# EAGLE schematic untitled (EAGLE 9.6.2)
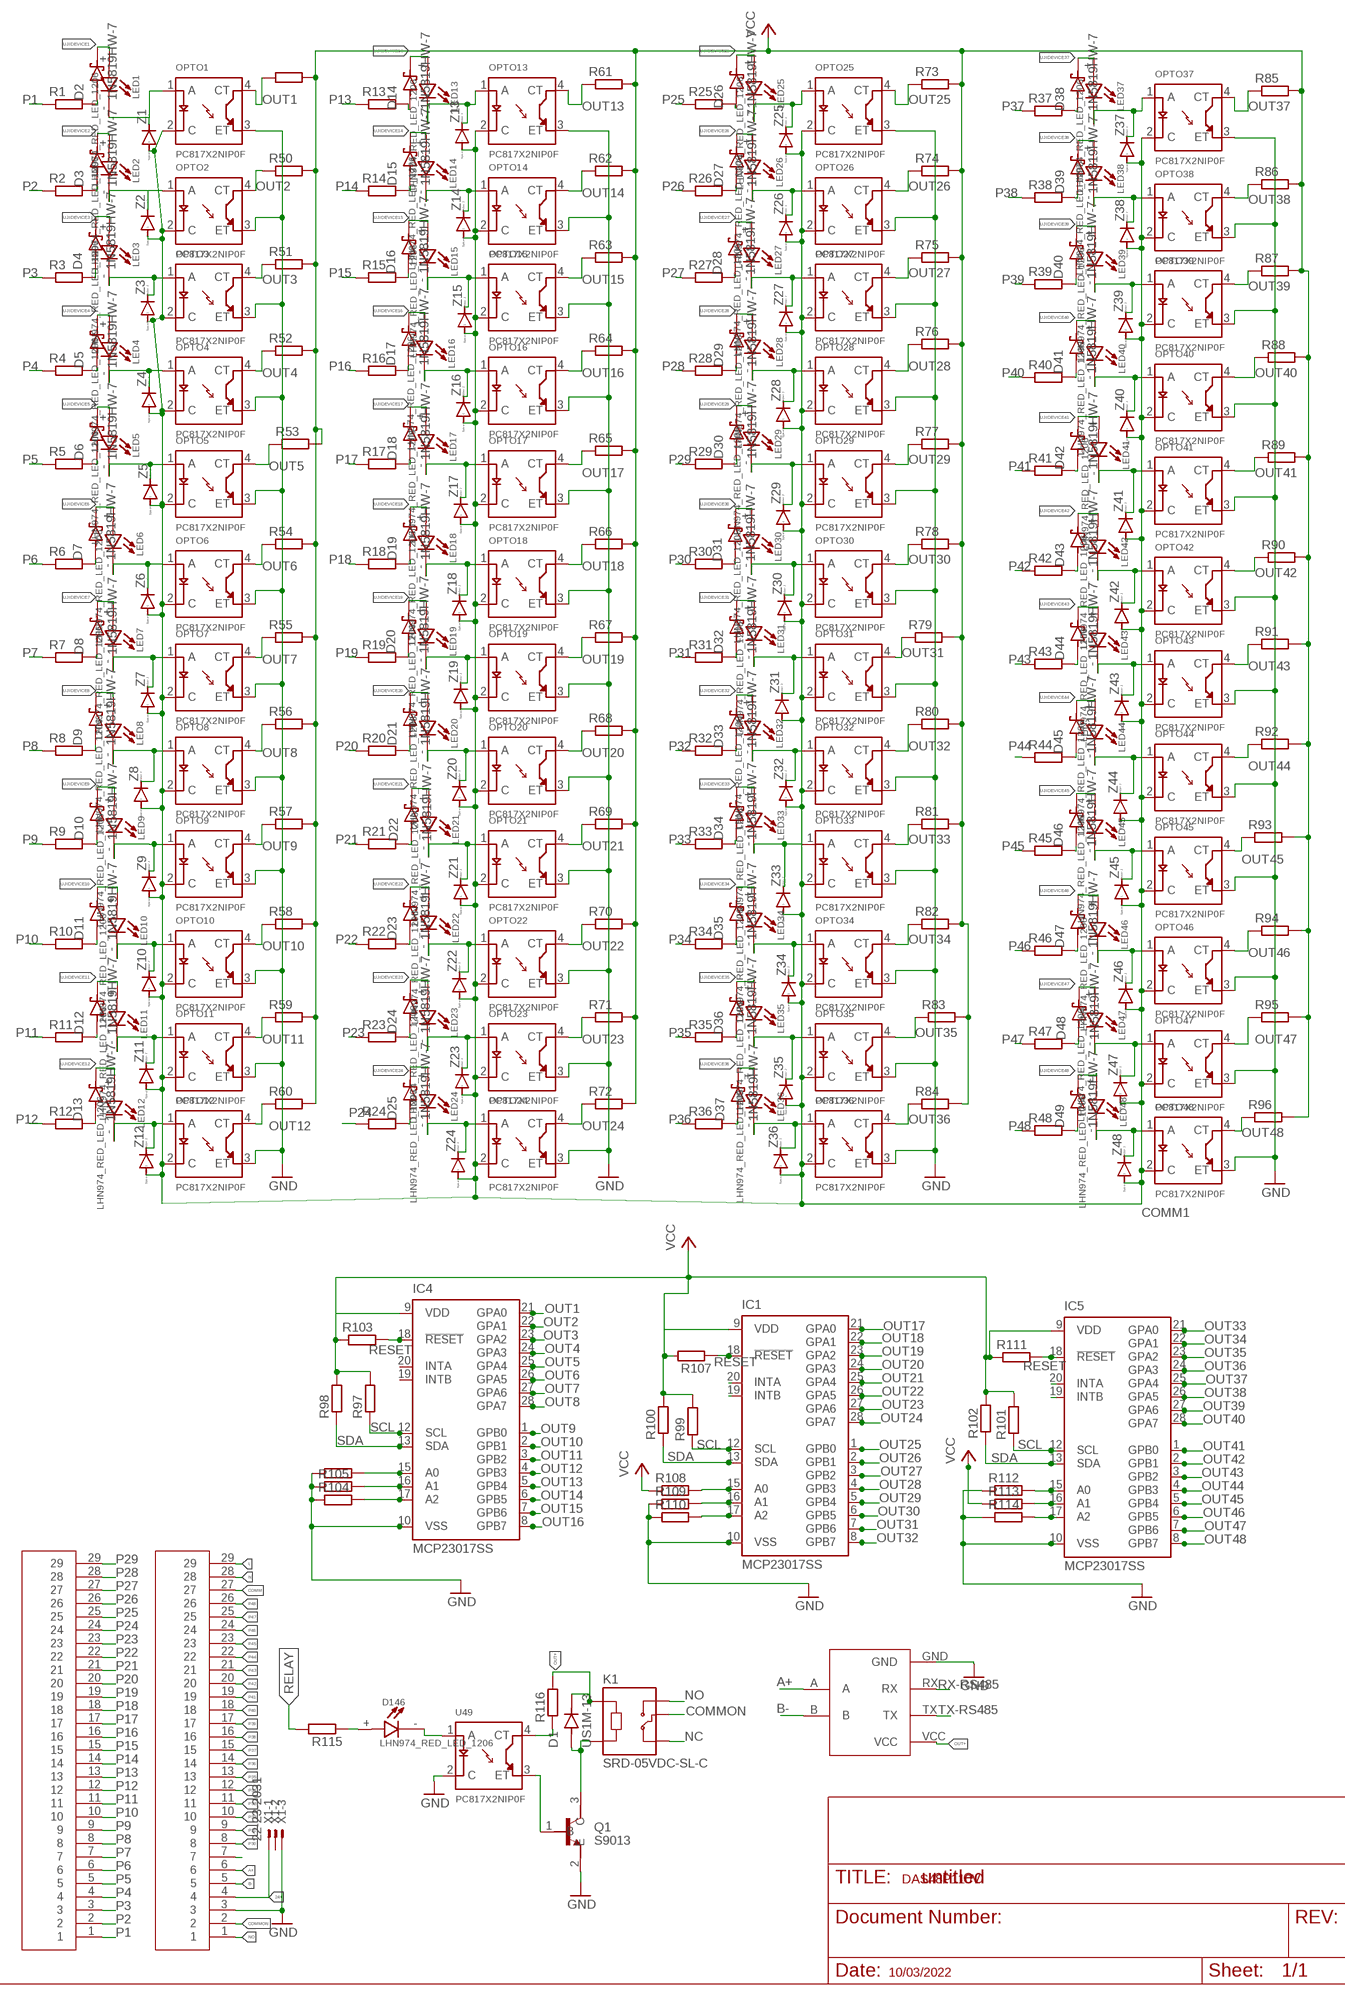
[diagram p0: schematic, sheet 1, part 1 of 2]
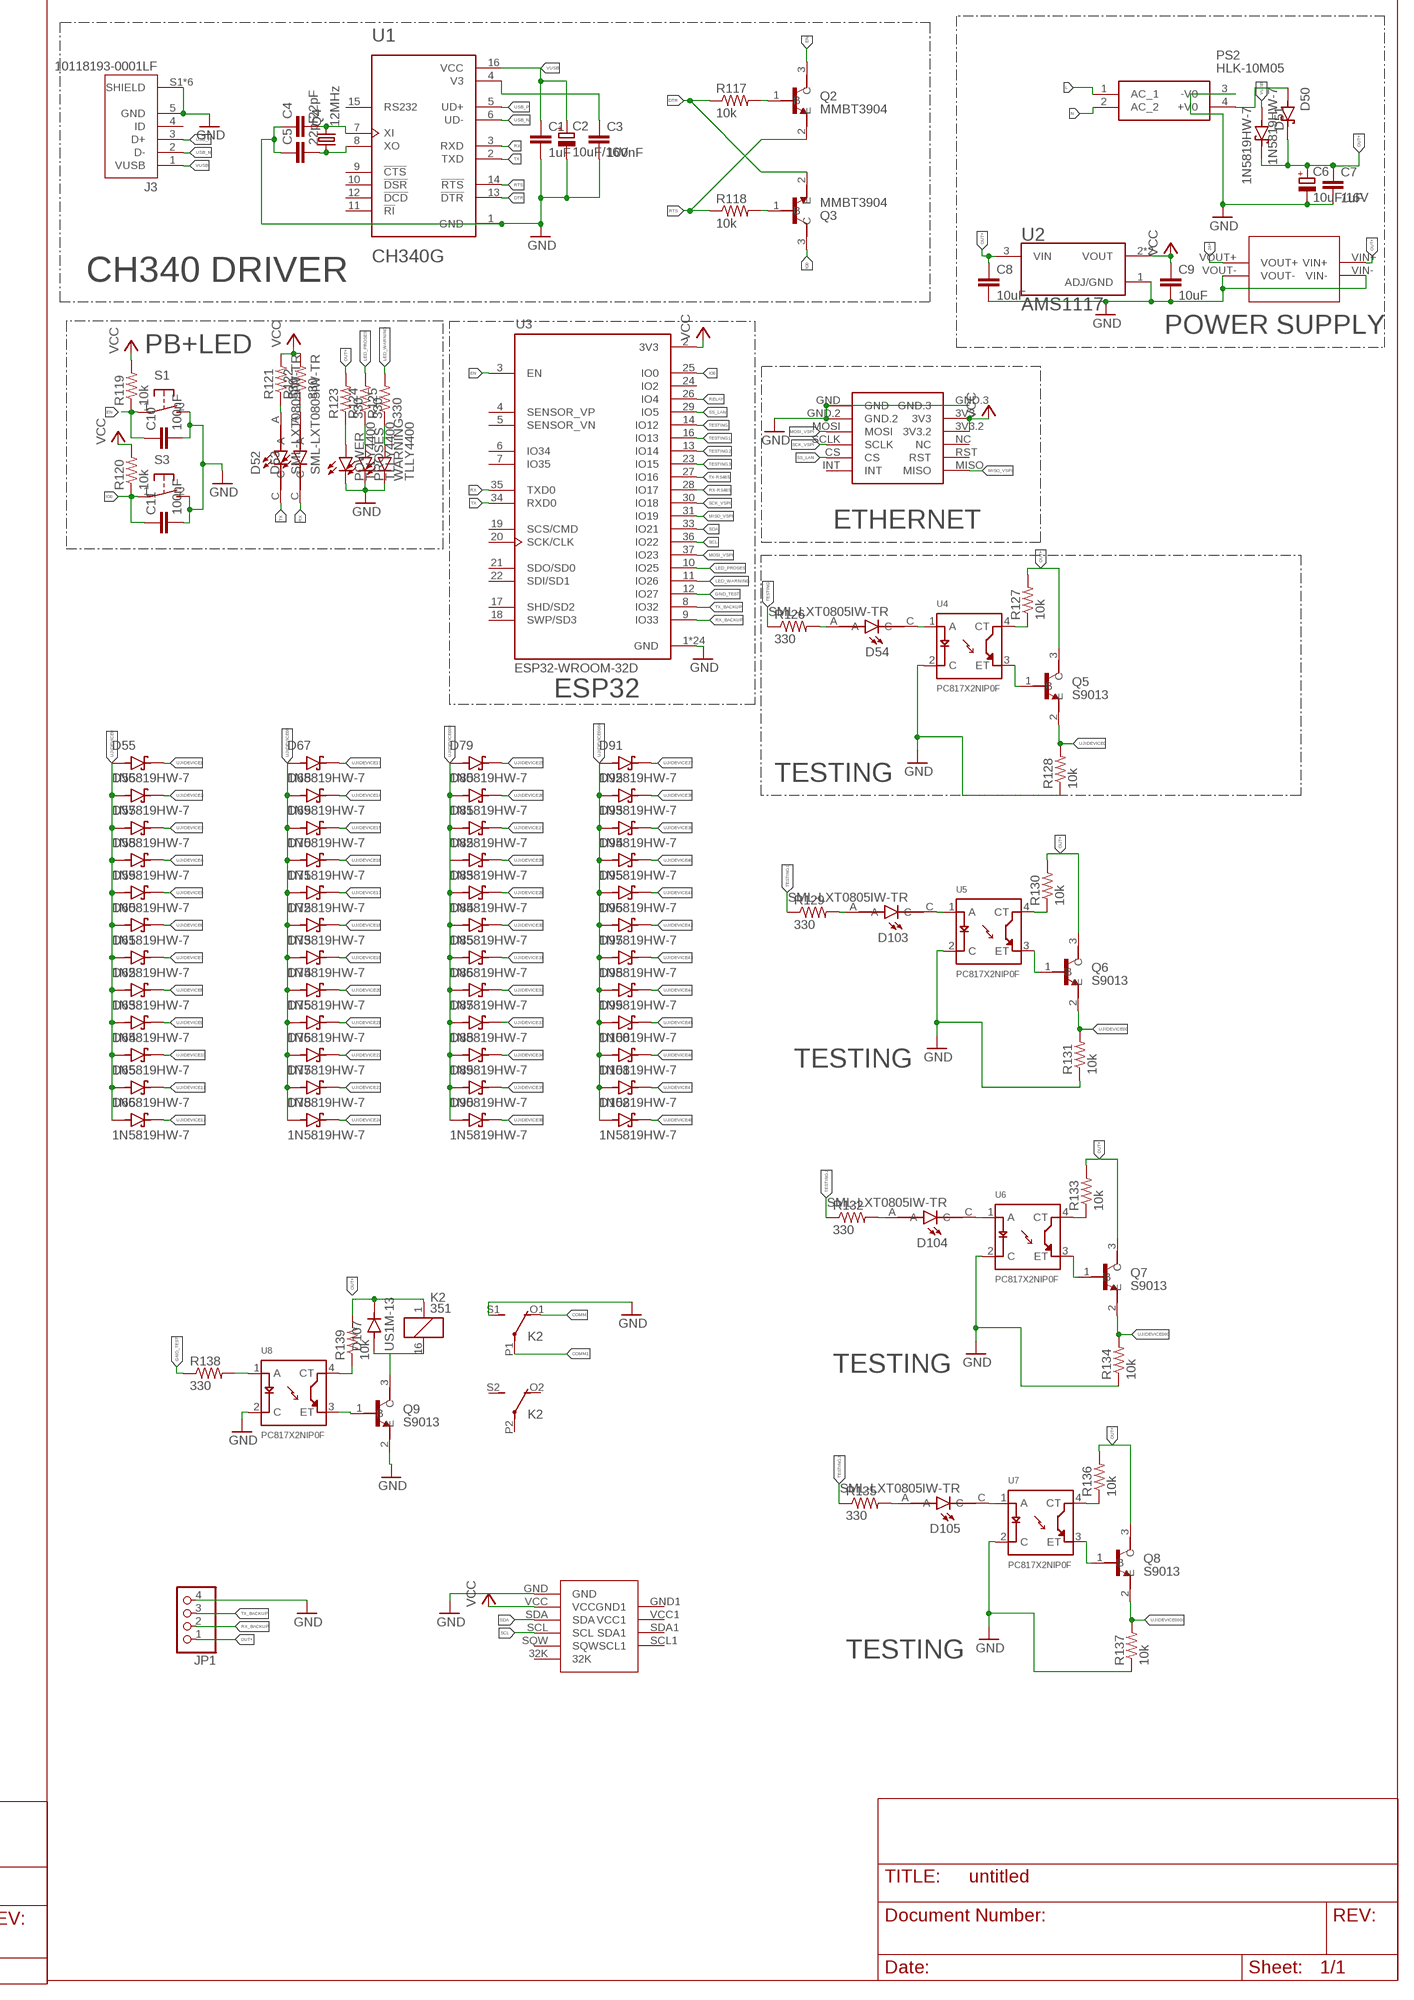
[diagram p1: schematic, sheet 1, part 2 of 2]

## Parts
C1  1uF  C-EUC0805K  [C0805K]
C2  10uF/16V  CPOL-EU153CLV-0505  [153CLV-0505]
C3  100nF  C-EUC0805K  [C0805K]
C4  22pF  C-EUC0805K  [C0805K]
C5  22pF  C-EUC0805K  [C0805K]
C6  10uF/16V  CPOL-EU153CLV-0505  [153CLV-0505]
C7  1uF  C-EUC0805K  [C0805K]
C8  10uF  C-EUC0805K  [C0805K]
C9  10uF  C-EUC0805K  [C0805K]
C10  100nF  C-EUC0805K  [C0805K]
C11  100nF  C-EUC0805K  [C0805K]
D1  US1M-13  [DIOM5226X240N]
D2  1N5819HW-7  [SOD3715X145N]
D3  1N5819HW-7  [SOD3715X145N]
D4  1N5819HW-7  [SOD3715X145N]
D5  1N5819HW-7  [SOD3715X145N]
D6  1N5819HW-7  [SOD3715X145N]
D7  1N5819HW-7  [SOD3715X145N]
D8  1N5819HW-7  [SOD3715X145N]
D9  1N5819HW-7  [SOD3715X145N]
D10  1N5819HW-7  [SOD3715X145N]
D11  1N5819HW-7  [SOD3715X145N]
D12  1N5819HW-7  [SOD3715X145N]
D13  1N5819HW-7  [SOD3715X145N]
D14  1N5819HW-7  [SOD3715X145N]
D15  1N5819HW-7  [SOD3715X145N]
D16  1N5819HW-7  [SOD3715X145N]
D17  1N5819HW-7  [SOD3715X145N]
D18  1N5819HW-7  [SOD3715X145N]
D19  1N5819HW-7  [SOD3715X145N]
D20  1N5819HW-7  [SOD3715X145N]
D21  1N5819HW-7  [SOD3715X145N]
D22  1N5819HW-7  [SOD3715X145N]
D23  1N5819HW-7  [SOD3715X145N]
D24  1N5819HW-7  [SOD3715X145N]
D25  1N5819HW-7  [SOD3715X145N]
D26  1N5819HW-7  [SOD3715X145N]
D27  1N5819HW-7  [SOD3715X145N]
D28  1N5819HW-7  [SOD3715X145N]
D29  1N5819HW-7  [SOD3715X145N]
D30  1N5819HW-7  [SOD3715X145N]
D31  1N5819HW-7  [SOD3715X145N]
D32  1N5819HW-7  [SOD3715X145N]
D33  1N5819HW-7  [SOD3715X145N]
D34  1N5819HW-7  [SOD3715X145N]
D35  1N5819HW-7  [SOD3715X145N]
D36  1N5819HW-7  [SOD3715X145N]
D37  1N5819HW-7  [SOD3715X145N]
D38  1N5819HW-7  [SOD3715X145N]
D39  1N5819HW-7  [SOD3715X145N]
D40  1N5819HW-7  [SOD3715X145N]
D41  1N5819HW-7  [SOD3715X145N]
D42  1N5819HW-7  [SOD3715X145N]
D43  1N5819HW-7  [SOD3715X145N]
D44  1N5819HW-7  [SOD3715X145N]
D45  1N5819HW-7  [SOD3715X145N]
D46  1N5819HW-7  [SOD3715X145N]
D47  1N5819HW-7  [SOD3715X145N]
D48  1N5819HW-7  [SOD3715X145N]
D49  1N5819HW-7  [SOD3715X145N]
D50  1N5819HW-7  [SOD3715X145N]
D51  1N5819HW-7  [SOD3715X145N]
D52  SML-LXT0805IW-TR  [LEDC2012X120N]
D53  SML-LXT0805IW-TR  [LEDC2012X120N]
D54  SML-LXT0805IW-TR  [LEDC2012X120N]
D55  1N5819HW-7  [SOD3715X145N]
D56  1N5819HW-7  [SOD3715X145N]
D57  1N5819HW-7  [SOD3715X145N]
D58  1N5819HW-7  [SOD3715X145N]
D59  1N5819HW-7  [SOD3715X145N]
D60  1N5819HW-7  [SOD3715X145N]
D61  1N5819HW-7  [SOD3715X145N]
D62  1N5819HW-7  [SOD3715X145N]
D63  1N5819HW-7  [SOD3715X145N]
D64  1N5819HW-7  [SOD3715X145N]
D65  1N5819HW-7  [SOD3715X145N]
D66  1N5819HW-7  [SOD3715X145N]
D67  1N5819HW-7  [SOD3715X145N]
D68  1N5819HW-7  [SOD3715X145N]
D69  1N5819HW-7  [SOD3715X145N]
D70  1N5819HW-7  [SOD3715X145N]
D71  1N5819HW-7  [SOD3715X145N]
D72  1N5819HW-7  [SOD3715X145N]
D73  1N5819HW-7  [SOD3715X145N]
D74  1N5819HW-7  [SOD3715X145N]
D75  1N5819HW-7  [SOD3715X145N]
D76  1N5819HW-7  [SOD3715X145N]
D77  1N5819HW-7  [SOD3715X145N]
D78  1N5819HW-7  [SOD3715X145N]
D79  1N5819HW-7  [SOD3715X145N]
D80  1N5819HW-7  [SOD3715X145N]
D81  1N5819HW-7  [SOD3715X145N]
D82  1N5819HW-7  [SOD3715X145N]
D83  1N5819HW-7  [SOD3715X145N]
D84  1N5819HW-7  [SOD3715X145N]
D85  1N5819HW-7  [SOD3715X145N]
D86  1N5819HW-7  [SOD3715X145N]
D87  1N5819HW-7  [SOD3715X145N]
D88  1N5819HW-7  [SOD3715X145N]
D89  1N5819HW-7  [SOD3715X145N]
D90  1N5819HW-7  [SOD3715X145N]
D91  1N5819HW-7  [SOD3715X145N]
D92  1N5819HW-7  [SOD3715X145N]
D93  1N5819HW-7  [SOD3715X145N]
D94  1N5819HW-7  [SOD3715X145N]
D95  1N5819HW-7  [SOD3715X145N]
D96  1N5819HW-7  [SOD3715X145N]
D97  1N5819HW-7  [SOD3715X145N]
D98  1N5819HW-7  [SOD3715X145N]
D99  1N5819HW-7  [SOD3715X145N]
D100  1N5819HW-7  [SOD3715X145N]
D101  1N5819HW-7  [SOD3715X145N]
D102  1N5819HW-7  [SOD3715X145N]
D103  SML-LXT0805IW-TR  [LEDC2012X120N]
D104  SML-LXT0805IW-TR  [LEDC2012X120N]
D105  SML-LXT0805IW-TR  [LEDC2012X120N]
D107  US1M-13  [DIOM5226X240N]
D146  LHN974_RED_LED_1206  [LEDC3216X120N]
HEADER-29P1  HEADER-29P  [HEADER-29P]
HEADER-29P2  HEADER-29P  [HEADER-29P]
IC1  MCP23017SS  [SSOP28DB]
IC4  MCP23017SS  [SSOP28DB]
IC5  MCP23017SS  [SSOP28DB]
J3  10118193-0001LF  [FCI_10118193-0001LF]
JP1  PINHD-1X4  [1X04]
K1  SRD-05VDC-SL-C  [RELAY_SRD-05VDC-SL-C]
K2  351  [351]
LED1  LHN974_RED_LED_1206  [LEDC3216X120N]
LED2  LHN974_RED_LED_1206  [LEDC3216X120N]
LED3  LHN974_RED_LED_1206  [LEDC3216X120N]
LED4  LHN974_RED_LED_1206  [LEDC3216X120N]
LED5  LHN974_RED_LED_1206  [LEDC3216X120N]
LED6  LHN974_RED_LED_1206  [LEDC3216X120N]
LED7  LHN974_RED_LED_1206  [LEDC3216X120N]
LED8  LHN974_RED_LED_1206  [LEDC3216X120N]
LED9  LHN974_RED_LED_1206  [LEDC3216X120N]
LED10  LHN974_RED_LED_1206  [LEDC3216X120N]
LED11  LHN974_RED_LED_1206  [LEDC3216X120N]
LED12  LHN974_RED_LED_1206  [LEDC3216X120N]
LED13  LHN974_RED_LED_1206  [LEDC3216X120N]
LED14  LHN974_RED_LED_1206  [LEDC3216X120N]
LED15  LHN974_RED_LED_1206  [LEDC3216X120N]
LED16  LHN974_RED_LED_1206  [LEDC3216X120N]
LED17  LHN974_RED_LED_1206  [LEDC3216X120N]
LED18  LHN974_RED_LED_1206  [LEDC3216X120N]
LED19  LHN974_RED_LED_1206  [LEDC3216X120N]
LED20  LHN974_RED_LED_1206  [LEDC3216X120N]
LED21  LHN974_RED_LED_1206  [LEDC3216X120N]
LED22  LHN974_RED_LED_1206  [LEDC3216X120N]
LED23  LHN974_RED_LED_1206  [LEDC3216X120N]
LED24  LHN974_RED_LED_1206  [LEDC3216X120N]
LED25  LHN974_RED_LED_1206  [LEDC3216X120N]
LED26  LHN974_RED_LED_1206  [LEDC3216X120N]
LED27  LHN974_RED_LED_1206  [LEDC3216X120N]
LED28  LHN974_RED_LED_1206  [LEDC3216X120N]
LED29  LHN974_RED_LED_1206  [LEDC3216X120N]
LED30  LHN974_RED_LED_1206  [LEDC3216X120N]
LED31  LHN974_RED_LED_1206  [LEDC3216X120N]
LED32  LHN974_RED_LED_1206  [LEDC3216X120N]
LED33  LHN974_RED_LED_1206  [LEDC3216X120N]
LED34  LHN974_RED_LED_1206  [LEDC3216X120N]
LED35  LHN974_RED_LED_1206  [LEDC3216X120N]
LED36  LHN974_RED_LED_1206  [LEDC3216X120N]
LED37  LHN974_RED_LED_1206  [LEDC3216X120N]
LED38  LHN974_RED_LED_1206  [LEDC3216X120N]
LED39  LHN974_RED_LED_1206  [LEDC3216X120N]
LED40  LHN974_RED_LED_1206  [LEDC3216X120N]
LED41  LHN974_RED_LED_1206  [LEDC3216X120N]
LED42  LHN974_RED_LED_1206  [LEDC3216X120N]
LED43  LHN974_RED_LED_1206  [LEDC3216X120N]
LED44  LHN974_RED_LED_1206  [LEDC3216X120N]
LED45  LHN974_RED_LED_1206  [LEDC3216X120N]
LED46  LHN974_RED_LED_1206  [LEDC3216X120N]
LED47  LHN974_RED_LED_1206  [LEDC3216X120N]
LED48  LHN974_RED_LED_1206  [LEDC3216X120N]
MT1  MT3608  [MT3608]
OPTO1  PC817X2NIP0F  [SOT254P975X400-4N]
OPTO2  PC817X2NIP0F  [SOT254P975X400-4N]
OPTO3  PC817X2NIP0F  [SOT254P975X400-4N]
OPTO4  PC817X2NIP0F  [SOT254P975X400-4N]
OPTO5  PC817X2NIP0F  [SOT254P975X400-4N]
OPTO6  PC817X2NIP0F  [SOT254P975X400-4N]
OPTO7  PC817X2NIP0F  [SOT254P975X400-4N]
OPTO8  PC817X2NIP0F  [SOT254P975X400-4N]
OPTO9  PC817X2NIP0F  [SOT254P975X400-4N]
OPTO10  PC817X2NIP0F  [SOT254P975X400-4N]
OPTO11  PC817X2NIP0F  [SOT254P975X400-4N]
OPTO12  PC817X2NIP0F  [SOT254P975X400-4N]
OPTO13  PC817X2NIP0F  [SOT254P975X400-4N]
OPTO14  PC817X2NIP0F  [SOT254P975X400-4N]
OPTO15  PC817X2NIP0F  [SOT254P975X400-4N]
OPTO16  PC817X2NIP0F  [SOT254P975X400-4N]
OPTO17  PC817X2NIP0F  [SOT254P975X400-4N]
OPTO18  PC817X2NIP0F  [SOT254P975X400-4N]
OPTO19  PC817X2NIP0F  [SOT254P975X400-4N]
OPTO20  PC817X2NIP0F  [SOT254P975X400-4N]
OPTO21  PC817X2NIP0F  [SOT254P975X400-4N]
OPTO22  PC817X2NIP0F  [SOT254P975X400-4N]
OPTO23  PC817X2NIP0F  [SOT254P975X400-4N]
OPTO24  PC817X2NIP0F  [SOT254P975X400-4N]
OPTO25  PC817X2NIP0F  [SOT254P975X400-4N]
OPTO26  PC817X2NIP0F  [SOT254P975X400-4N]
OPTO27  PC817X2NIP0F  [SOT254P975X400-4N]
OPTO28  PC817X2NIP0F  [SOT254P975X400-4N]
OPTO29  PC817X2NIP0F  [SOT254P975X400-4N]
OPTO30  PC817X2NIP0F  [SOT254P975X400-4N]
OPTO31  PC817X2NIP0F  [SOT254P975X400-4N]
OPTO32  PC817X2NIP0F  [SOT254P975X400-4N]
OPTO33  PC817X2NIP0F  [SOT254P975X400-4N]
OPTO34  PC817X2NIP0F  [SOT254P975X400-4N]
OPTO35  PC817X2NIP0F  [SOT254P975X400-4N]
OPTO36  PC817X2NIP0F  [SOT254P975X400-4N]
OPTO37  PC817X2NIP0F  [SOT254P975X400-4N]
OPTO38  PC817X2NIP0F  [SOT254P975X400-4N]
OPTO39  PC817X2NIP0F  [SOT254P975X400-4N]
OPTO40  PC817X2NIP0F  [SOT254P975X400-4N]
OPTO41  PC817X2NIP0F  [SOT254P975X400-4N]
OPTO42  PC817X2NIP0F  [SOT254P975X400-4N]
OPTO43  PC817X2NIP0F  [SOT254P975X400-4N]
OPTO44  PC817X2NIP0F  [SOT254P975X400-4N]
OPTO45  PC817X2NIP0F  [SOT254P975X400-4N]
OPTO46  PC817X2NIP0F  [SOT254P975X400-4N]
OPTO47  PC817X2NIP0F  [SOT254P975X400-4N]
OPTO48  PC817X2NIP0F  [SOT254P975X400-4N]
POWER  TLLY4400  [LED3MM]
PROSES  TLLY4400  [LED3MM]
PS2  HLK-10M05  [HLK10M05]
Q1  S9013  [SOT95P240X120-3N]
Q2  MMBT3904  [SOT95P240X120-3N]
Q3  MMBT3904  [SOT95P240X120-3N]
Q4  12MHz  CRYSTALSM49  [SM49]
Q5  S9013  [SOT95P240X120-3N]
Q6  S9013  [SOT95P240X120-3N]
Q7  S9013  [SOT95P240X120-3N]
Q8  S9013  [SOT95P240X120-3N]
Q9  S9013  [SOT95P240X120-3N]
R1  R-EU_0617/17  [0617/17]
R2  R-EU_0617/17  [0617/17]
R3  R-EU_0617/17  [0617/17]
R4  R-EU_0617/17  [0617/17]
R5  R-EU_0617/17  [0617/17]
R6  R-EU_0617/17  [0617/17]
R7  R-EU_0617/17  [0617/17]
R8  R-EU_0617/17  [0617/17]
R9  R-EU_0617/17  [0617/17]
R10  R-EU_0617/17  [0617/17]
R11  R-EU_0617/17  [0617/17]
R12  R-EU_0617/17  [0617/17]
R13  R-EU_0617/17  [0617/17]
R14  R-EU_0617/17  [0617/17]
R15  R-EU_0617/17  [0617/17]
R16  R-EU_0617/17  [0617/17]
R17  R-EU_0617/17  [0617/17]
R18  R-EU_0617/17  [0617/17]
R19  R-EU_0617/17  [0617/17]
R20  R-EU_0617/17  [0617/17]
R21  R-EU_0617/17  [0617/17]
R22  R-EU_0617/17  [0617/17]
R23  R-EU_0617/17  [0617/17]
R24  R-EU_0617/17  [0617/17]
R25  R-EU_0617/17  [0617/17]
R26  R-EU_0617/17  [0617/17]
R27  R-EU_0617/17  [0617/17]
R28  R-EU_0617/17  [0617/17]
R29  R-EU_0617/17  [0617/17]
R30  R-EU_0617/17  [0617/17]
R31  R-EU_0617/17  [0617/17]
R32  R-EU_0617/17  [0617/17]
R33  R-EU_0617/17  [0617/17]
R34  R-EU_0617/17  [0617/17]
R35  R-EU_0617/17  [0617/17]
R36  R-EU_0617/17  [0617/17]
R37  R-EU_0617/17  [0617/17]
R38  R-EU_0617/17  [0617/17]
R39  R-EU_0617/17  [0617/17]
R40  R-EU_0617/17  [0617/17]
R41  R-EU_0617/17  [0617/17]
R42  R-EU_0617/17  [0617/17]
R43  R-EU_0617/17  [0617/17]
R44  R-EU_0617/17  [0617/17]
R45  R-EU_0617/17  [0617/17]
R46  R-EU_0617/17  [0617/17]
R47  R-EU_0617/17  [0617/17]
R48  R-EU_0617/17  [0617/17]
R49  R-EU_R0805  [R0805]
R50  R-EU_R0805  [R0805]
R51  R-EU_R0805  [R0805]
R52  R-EU_R0805  [R0805]
R53  R-EU_R0805  [R0805]
R54  R-EU_R0805  [R0805]
R55  R-EU_R0805  [R0805]
R56  R-EU_R0805  [R0805]
R57  R-EU_R0805  [R0805]
R58  R-EU_R0805  [R0805]
R59  R-EU_R0805  [R0805]
R60  R-EU_R0805  [R0805]
R61  R-EU_R0805  [R0805]
R62  R-EU_R0805  [R0805]
R63  R-EU_R0805  [R0805]
R64  R-EU_R0805  [R0805]
R65  R-EU_R0805  [R0805]
R66  R-EU_R0805  [R0805]
R67  R-EU_R0805  [R0805]
R68  R-EU_R0805  [R0805]
R69  R-EU_R0805  [R0805]
R70  R-EU_R0805  [R0805]
R71  R-EU_R0805  [R0805]
R72  R-EU_R0805  [R0805]
R73  R-EU_R0805  [R0805]
R74  R-EU_R0805  [R0805]
R75  R-EU_R0805  [R0805]
R76  R-EU_R0805  [R0805]
R77  R-EU_R0805  [R0805]
R78  R-EU_R0805  [R0805]
R79  R-EU_R0805  [R0805]
R80  R-EU_R0805  [R0805]
R81  R-EU_R0805  [R0805]
R82  R-EU_R0805  [R0805]
R83  R-EU_R0805  [R0805]
R84  R-EU_R0805  [R0805]
R85  R-EU_R0805  [R0805]
R86  R-EU_R0805  [R0805]
R87  R-EU_R0805  [R0805]
R88  R-EU_R0805  [R0805]
R89  R-EU_R0805  [R0805]
R90  R-EU_R0805  [R0805]
R91  R-EU_R0805  [R0805]
R92  R-EU_R0805  [R0805]
R93  R-EU_R0805  [R0805]
R94  R-EU_R0805  [R0805]
R95  R-EU_R0805  [R0805]
R96  R-EU_R0805  [R0805]
R97  R-EU_R0805  [R0805]
R98  R-EU_R0805  [R0805]
R99  R-EU_R0805  [R0805]
R100  R-EU_R0805  [R0805]
R101  R-EU_R0805  [R0805]
R102  R-EU_R0805  [R0805]
R103  R-EU_R0805  [R0805]
R104  R-EU_R0805  [R0805]
R105  R-EU_R0805  [R0805]
R106  R-EU_R0805  [R0805]
R107  R-EU_R0805  [R0805]
R108  R-EU_R0805  [R0805]
R109  R-EU_R0805  [R0805]
R110  R-EU_R0805  [R0805]
R111  R-EU_R0805  [R0805]
R112  R-EU_R0805  [R0805]
R113  R-EU_R0805  [R0805]
R114  R-EU_R0805  [R0805]
R115  R-EU_R0805  [R0805]
R116  R-EU_R0805  [R0805]
R117  10k  R-US_M0805  [M0805]
R118  10k  R-US_M0805  [M0805]
R119  10k  R-US_M0805  [M0805]
R120  10k  R-US_M0805  [M0805]
R121  330  R-US_M0805  [M0805]
R122  330  R-US_M0805  [M0805]
R123  330  R-US_M0805  [M0805]
R124  330  R-US_M0805  [M0805]
R125  330  R-US_M0805  [M0805]
R126  330  R-US_M0805  [M0805]
R127  10k  R-US_M0805  [M0805]
R128  10k  R-US_M0805  [M0805]
R129  330  R-US_M0805  [M0805]
R130  10k  R-US_M0805  [M0805]
R131  10k  R-US_M0805  [M0805]
R132  330  R-US_M0805  [M0805]
R133  10k  R-US_M0805  [M0805]
R134  10k  R-US_M0805  [M0805]
R135  330  R-US_M0805  [M0805]
R136  10k  R-US_M0805  [M0805]
R137  10k  R-US_M0805  [M0805]
R138  330  R-US_M0805  [M0805]
R139  10k  R-US_M0805  [M0805]
RTC1  RTC3231  [RTC3231]
S1  31-XX  [B3F-31XX]
S3  31-XX  [B3F-31XX]
TTL-RS1  TTL-RS485  [TTL-RS485]
U1  CH340G  [SOIC127P600X180-16N]
U2  AMS1117  [SOT229P700X180-4N]
U3  ESP32-WROOM-32D  [MODULE_ESP32-WROOM-32D]
U4  PC817X2NIP0F  [SOT254P975X400-4N]
U5  PC817X2NIP0F  [SOT254P975X400-4N]
U6  PC817X2NIP0F  [SOT254P975X400-4N]
U7  PC817X2NIP0F  [SOT254P975X400-4N]
U8  PC817X2NIP0F  [SOT254P975X400-4N]
U49  PC817X2NIP0F  [SOT254P975X400-4N]
U$1  MINI_W5500  [MINI_W5500]
WARNING  TLLY4400  [LED3MM]
X1  22-23-2031  [22-23-2031]
Z1  DIODE-SOD123  [SOD123]
Z2  DIODE-SOD123  [SOD123]
Z3  DIODE-SOD123  [SOD123]
Z4  DIODE-SOD123  [SOD123]
Z5  DIODE-SOD123  [SOD123]
Z6  DIODE-SOD123  [SOD123]
Z7  DIODE-SOD123  [SOD123]
Z8  DIODE-SOD123  [SOD123]
Z9  DIODE-SOD123  [SOD123]
Z10  DIODE-SOD123  [SOD123]
Z11  DIODE-SOD123  [SOD123]
Z12  DIODE-SOD123  [SOD123]
Z13  DIODE-SOD123  [SOD123]
Z14  DIODE-SOD123  [SOD123]
Z15  DIODE-SOD123  [SOD123]
Z16  DIODE-SOD123  [SOD123]
Z17  DIODE-SOD123  [SOD123]
Z18  DIODE-SOD123  [SOD123]
Z19  DIODE-SOD123  [SOD123]
Z20  DIODE-SOD123  [SOD123]
Z21  DIODE-SOD123  [SOD123]
Z22  DIODE-SOD123  [SOD123]
Z23  DIODE-SOD123  [SOD123]
Z24  DIODE-SOD123  [SOD123]
Z25  DIODE-SOD123  [SOD123]
Z26  DIODE-SOD123  [SOD123]
Z27  DIODE-SOD123  [SOD123]
Z28  DIODE-SOD123  [SOD123]
Z29  DIODE-SOD123  [SOD123]
Z30  DIODE-SOD123  [SOD123]
Z31  DIODE-SOD123  [SOD123]
Z32  DIODE-SOD123  [SOD123]
Z33  DIODE-SOD123  [SOD123]
Z34  DIODE-SOD123  [SOD123]
Z35  DIODE-SOD123  [SOD123]
Z36  DIODE-SOD123  [SOD123]
Z37  DIODE-SOD123  [SOD123]
Z38  DIODE-SOD123  [SOD123]
Z39  DIODE-SOD123  [SOD123]
Z40  DIODE-SOD123  [SOD123]
Z41  DIODE-SOD123  [SOD123]
Z42  DIODE-SOD123  [SOD123]
Z43  DIODE-SOD123  [SOD123]
Z44  DIODE-SOD123  [SOD123]
Z45  DIODE-SOD123  [SOD123]
Z46  DIODE-SOD123  [SOD123]
Z47  DIODE-SOD123  [SOD123]
Z48  DIODE-SOD123  [SOD123]

## Nets
24+: HEADER-29P2.4 MT1.VOUT+ X1.1
A+: HEADER-29P2.6 TTL-RS1.A
B-: HEADER-29P2.5 TTL-RS1.B
COMM: HEADER-29P2.27 K2.O1(2:O)
COMM1: K2.P1(2:P) OPTO1.2(C) OPTO2.2(C) OPTO3.2(C) OPTO4.2(C) OPTO5.2(C) OPTO6.2(C) OPTO7.2(C) OPTO8.2(C) OPTO9.2(C) OPTO10.2(C) OPTO11.2(C) OPTO12.2(C) OPTO13.2(C) OPTO14.2(C) OPTO15.2(C) OPTO16.2(C) OPTO17.2(C) OPTO18.2(C) OPTO19.2(C) OPTO20.2(C) OPTO21.2(C) OPTO22.2(C) OPTO23.2(C) OPTO24.2(C) OPTO25.2(C) OPTO26.2(C) OPTO27.2(C) OPTO28.2(C) OPTO29.2(C) OPTO30.2(C) OPTO31.2(C) OPTO32.2(C) OPTO33.2(C) OPTO34.2(C) OPTO35.2(C) OPTO36.2(C) OPTO37.2(C) OPTO38.2(C) OPTO39.2(C) OPTO40.2(C) OPTO41.2(C) OPTO42.2(C) OPTO43.2(C) OPTO44.2(C) OPTO45.2(C) OPTO46.2(C) OPTO47.2(C) OPTO48.2(C) Z1.A Z2.A Z3.A Z4.A Z5.A Z6.A Z7.A Z8.A Z9.A Z10.A Z11.A Z12.A Z13.A Z14.A Z15.A Z16.A Z17.A Z18.A Z19.A Z20.A Z21.A Z22.A Z23.A Z24.A Z25.A Z26.A Z27.A Z28.A Z29.A Z30.A Z31.A Z32.A Z33.A Z34.A Z35.A Z36.A Z37.A Z38.A Z39.A Z40.A Z41.A Z42.A Z43.A Z44.A Z45.A Z46.A Z47.A Z48.A
COMMON: HEADER-29P2.2 K1.COM
DTR: Q3.2(E) R117.1 U1.13(!DTR)
EN: C10.1 Q2.3(C) R119.1 S1.1(P) U3.3(EN)
GND: C1.2 C2.- C3.2 C4.1 C5.1 C6.- C7.2 C8.2 C9.2 C10.2 C11.2 HEADER-29P2.3 IC1.10(VSS) IC4.10(VSS) IC5.10(VSS) J3.5(GND) J3.S1(SHIELD) J3.S2(SHIELD) J3.S3(SHIELD) J3.S4(SHIELD) J3.S5(SHIELD) J3.S6(SHIELD) JP1.4 K2.S1(2:S) MT1.VIN- MT1.VOUT- OPTO1.3(ET) OPTO2.3(ET) OPTO3.3(ET) OPTO4.3(ET) OPTO5.3(ET) OPTO6.3(ET) OPTO7.3(ET) OPTO8.3(ET) OPTO9.3(ET) OPTO10.3(ET) OPTO11.3(ET) OPTO12.3(ET) OPTO13.3(ET) OPTO14.3(ET) OPTO15.3(ET) OPTO16.3(ET) OPTO17.3(ET) OPTO18.3(ET) OPTO19.3(ET) OPTO20.3(ET) OPTO21.3(ET) OPTO22.3(ET) OPTO23.3(ET) OPTO24.3(ET) OPTO25.3(ET) OPTO26.3(ET) OPTO27.3(ET) OPTO28.3(ET) OPTO29.3(ET) OPTO30.3(ET) OPTO31.3(ET) OPTO32.3(ET) OPTO33.3(ET) OPTO34.3(ET) OPTO35.3(ET) OPTO36.3(ET) OPTO37.3(ET) OPTO38.3(ET) OPTO39.3(ET) OPTO40.3(ET) OPTO41.3(ET) OPTO42.3(ET) OPTO43.3(ET) OPTO44.3(ET) OPTO45.3(ET) OPTO46.3(ET) OPTO47.3(ET) OPTO48.3(ET) POWER.K(C) PROSES.K(C) PS2.3(-V0) Q1.2(E) Q9.2(E) R104.1 R105.1 R106.1 R109.1 R110.1 R112.1 R114.1 R128.1 R131.1 R134.1 R137.1 RTC1.GND S1.2(S) S3.2(S) TTL-RS1.GND U1.1(GND) U2.1(ADJ/GND) U3.1(GND) U3.15(GND) U3.38(GND) U3.39_1(GND) U3.39_2(GND) U3.39_3(GND) U3.39_4(GND) U3.39_5(GND) U3.39_6(GND) U3.39_7(GND) U3.39_8(GND) U3.39_9(GND) U3.39_10(GND) U3.39_11(GND) U3.39_12(GND) U3.39_13(GND) U3.39_14(GND) U3.39_15(GND) U3.39_16(GND) U3.39_17(GND) U3.39_18(GND) U3.39_19(GND) U3.39_20(GND) U3.39_21(GND) U4.2(C) U5.2(C) U6.2(C) U7.2(C) U8.2(C) U49.2(C) U$1.GND U$1.GND.2 U$1.GND.3 WARNING.K(C) X1.3
GND_TEST: R138.1 U3.12(IO27)
IO0: C11.1 Q3.3(C) R120.1 S3.1(P) U3.25(IO0)
L: HEADER-29P2.29 PS2.1(AC_1)
LED_PROSES: R124.2 U3.10(IO25)
LED_WARNING: R125.2 U3.11(IO26)
MISO_VSPI: U3.31(IO19) U$1.MISO
MOSI_VSPI: U3.37(IO23) U$1.MOSI
N: HEADER-29P2.28 PS2.2(AC_2)
N$1: D2.A R1.2
N$2: D50.A PS2.4(+V0)
N$3: D3.A R2.2
N$4: Q5.1(B) U4.3(ET)
N$5: D4.A R3.2
N$6: R127.1 U4.4(CT)
N$7: D5.A R4.2
N$8: D103.A R129.2
N$9: D6.A R5.2
N$10: D103.C U5.1(A)
N$11: D7.A R6.2
N$12: Q6.1(B) U5.3(ET)
N$13: D8.A R7.2
N$14: R130.1 U5.4(CT)
N$15: D9.A R8.2
N$16: D104.A R132.2
N$17: D15.A R14.2
N$18: LED1.- OPTO1.1(A) Z1.C
N$19: LED13.- OPTO13.1(A) Z13.C
N$20: D10.A R9.2
N$21: LED14.- OPTO14.1(A) Z14.C
N$22: D104.C U6.1(A)
N$23: LED15.- OPTO15.1(A) Z15.C
N$24: D11.A R10.2
N$25: LED16.- OPTO16.1(A) Z16.C
N$26: Q7.1(B) U6.3(ET)
N$27: LED17.- OPTO17.1(A) Z17.C
N$28: D12.A R11.2
N$29: LED18.- OPTO18.1(A) Z18.C
N$30: R133.1 U6.4(CT)
N$31: LED19.- OPTO19.1(A) Z19.C
N$32: LED20.- OPTO20.1(A) Z20.C
N$33: LED21.- OPTO21.1(A) Z21.C
N$34: D105.A R135.2
N$35: LED22.- OPTO22.1(A) Z22.C
N$36: D13.A R12.2
N$37: LED23.- OPTO23.1(A) Z23.C
N$38: D105.C U7.1(A)
N$39: LED24.- OPTO24.1(A) Z24.C
N$40: D14.A R13.2
N$41: LED25.- OPTO25.1(A) Z25.C
N$42: Q8.1(B) U7.3(ET)
N$43: LED26.- OPTO26.1(A) Z26.C
N$44: D16.A R15.2
N$45: LED27.- OPTO27.1(A) Z27.C
N$46: R136.1 U7.4(CT)
N$47: LED28.- OPTO28.1(A) Z28.C
N$48: D17.A R16.2
N$49: LED29.- OPTO29.1(A) Z29.C
N$51: LED30.- OPTO30.1(A) Z30.C
N$52: D18.A R17.2
N$53: LED31.- OPTO31.1(A) Z31.C
N$54: R138.2 U8.1(A)
N$55: LED32.- OPTO32.1(A) Z32.C
N$56: D19.A R18.2
N$57: LED33.- OPTO33.1(A) Z33.C
N$58: R139.1 U8.4(CT)
N$59: LED34.- OPTO34.1(A) Z34.C
N$60: D20.A R19.2
N$61: LED35.- OPTO35.1(A) Z35.C
N$62: Q9.1(B) U8.3(ET)
N$63: LED36.- OPTO36.1(A) Z36.C
N$64: D32.A R31.2
N$65: LED37.- OPTO37.1(A) Z37.C
N$66: D21.A R20.2
N$67: LED38.- OPTO38.1(A) Z38.C
N$69: LED39.- OPTO39.1(A) Z39.C
N$70: LED40.- OPTO40.1(A) Z40.C
N$71: D22.A R21.2
N$72: LED41.- OPTO41.1(A) Z41.C
N$73: D107.A K2.16 Q9.3(C)
N$74: LED42.- OPTO42.1(A) Z42.C
N$75: LED43.- OPTO43.1(A) Z43.C
N$76: D23.A R22.2
N$77: LED44.- OPTO44.1(A) Z44.C
N$79: LED45.- OPTO45.1(A) Z45.C
N$80: D24.A R23.2
N$81: LED46.- OPTO46.1(A) Z46.C
N$83: LED47.- OPTO47.1(A) Z47.C
N$84: D25.A R24.2
N$85: LED48.- OPTO48.1(A) Z48.C
N$86: LED2.- OPTO2.1(A) Z2.C
N$87: LED3.- OPTO3.1(A) Z3.C
N$88: LED4.- OPTO4.1(A) Z4.C
N$89: LED5.- OPTO5.1(A) Z5.C
N$90: LED6.- OPTO6.1(A) Z6.C
N$91: LED7.- OPTO7.1(A) Z7.C
N$92: LED8.- OPTO8.1(A) Z8.C
N$93: LED9.- OPTO9.1(A) Z9.C
N$94: LED10.- OPTO10.1(A) Z10.C
N$95: LED11.- OPTO11.1(A) Z11.C
N$96: LED12.- OPTO12.1(A) Z12.C
N$97: D146.- U49.1(A)
N$98: D146.+ R115.1
N$99: R116.1 U49.4(CT)
N$100: IC5.15(A0) R112.2
N$101: D1.A K1.A2 Q1.3(C)
N$102: Q1.1(B) U49.3(ET)
N$103: IC5.16(A1) R113.2
N$105: D26.A R25.2
N$107: IC1.15(A0) R108.2
N$108: IC1.16(A1) R109.2
N$109: IC4.15(A0) R106.2
N$110: IC4.16(A1) R105.2
N$111: IC4.17(A2) R104.2
N$112: IC5.17(A2) R114.2
N$113: IC1.17(A2) R110.2
N$114: D27.A R26.2
N$116: D28.A R27.2
N$119: D29.A R28.2
N$122: D30.A R29.2
N$123: D31.A R30.2
N$126: D33.A R32.2
N$127: D35.A R34.2
N$129: D36.A R35.2
N$131: D42.A R41.2
N$132: D37.A R36.2
N$134: D38.A R37.2
N$135: IC1.20(INTA)
N$136: IC1.19(INTB)
N$137: IC5.20(INTA)
N$138: D34.A R33.2
N$140: IC5.19(INTB)
N$143: D39.A R38.2
N$145: D40.A R39.2
N$147: D41.A R40.2
N$151: D43.A R42.2
N$153: D44.A R43.2
N$155: D45.A R44.2
N$157: D46.A R45.2
N$159: D47.A R46.2
N$162: D54.A R126.2
N$163: D54.C U4.1(A)
N$164: D48.A R47.2
N$165: D49.A R48.2
N$168: C3.1 U1.4(V3)
N$169: C4.2 Q4.2 U1.7(XI)
N$170: C5.2 Q4.1 U1.8(XO)
N$173: POWER.A R123.1
N$174: PROSES.A R124.1
N$175: Q2.1(B) R117.2
N$176: Q3.1(B) R118.2
N$177: R125.1 WARNING.A
N$178: D52.A R121.1
N$179: D53.A R122.1
N$202: HEADER-29P2.7
NC: K1.NC
NO: HEADER-29P2.1 K1.NO
OUT1: IC4.21(GPA0) OPTO1.4(CT) R49.1
OUT2: IC4.22(GPA1) OPTO2.4(CT) R50.1
OUT3: IC4.23(GPA2) OPTO3.4(CT) R51.1
OUT4: IC4.24(GPA3) OPTO4.4(CT) R52.1
OUT5: IC4.25(GPA4) OPTO5.4(CT) R53.1
OUT6: IC4.26(GPA5) OPTO6.4(CT) R54.1
OUT7: IC4.27(GPA6) OPTO7.4(CT) R55.1
OUT8: IC4.28(GPA7) OPTO8.4(CT) R56.1
OUT9: IC4.1(GPB0) OPTO9.4(CT) R57.1
OUT10: IC4.2(GPB1) OPTO10.4(CT) R58.1
OUT11: IC4.3(GPB2) OPTO11.4(CT) R59.1
OUT12: IC4.4(GPB3) OPTO12.4(CT) R60.1
OUT13: IC4.5(GPB4) OPTO13.4(CT) R61.1
OUT14: IC4.6(GPB5) OPTO14.4(CT) R62.1
OUT15: IC4.7(GPB6) OPTO15.4(CT) R63.1
OUT16: IC4.8(GPB7) OPTO16.4(CT) R64.1
OUT17: IC1.21(GPA0) OPTO17.4(CT) R65.1
OUT18: IC1.22(GPA1) OPTO18.4(CT) R66.1
OUT19: IC1.23(GPA2) OPTO19.4(CT) R67.1
OUT20: IC1.24(GPA3) OPTO20.4(CT) R68.1
OUT21: IC1.25(GPA4) OPTO21.4(CT) R69.1
OUT22: IC1.26(GPA5) OPTO22.4(CT) R70.1
OUT23: IC1.27(GPA6) OPTO23.4(CT) R71.1
OUT24: IC1.28(GPA7) OPTO24.4(CT) R72.1
OUT25: IC1.1(GPB0) OPTO25.4(CT) R73.1
OUT26: IC1.2(GPB1) OPTO26.4(CT) R74.1
OUT27: IC1.3(GPB2) OPTO27.4(CT) R75.1
OUT28: IC1.4(GPB3) OPTO28.4(CT) R76.1
OUT29: IC1.5(GPB4) OPTO29.4(CT) R77.1
OUT30: IC1.6(GPB5) OPTO30.4(CT) R78.1
OUT31: IC1.7(GPB6) OPTO31.4(CT) R79.1
OUT32: IC1.8(GPB7) OPTO32.4(CT) R80.1
OUT33: IC5.21(GPA0) OPTO33.4(CT) R81.1
OUT34: IC5.22(GPA1) OPTO34.4(CT) R82.1
OUT35: IC5.23(GPA2) OPTO35.4(CT) R83.1
OUT36: IC5.24(GPA3) OPTO36.4(CT) R84.1
OUT37: IC5.25(GPA4) OPTO37.4(CT) R85.1
OUT38: IC5.26(GPA5) OPTO38.4(CT) R86.1
OUT39: IC5.27(GPA6) OPTO39.4(CT) R87.1
OUT40: IC5.28(GPA7) OPTO40.4(CT) R88.1
OUT41: IC5.1(GPB0) OPTO41.4(CT) R89.1
OUT42: IC5.2(GPB1) OPTO42.4(CT) R90.1
OUT43: IC5.3(GPB2) OPTO43.4(CT) R91.1
OUT44: IC5.4(GPB3) OPTO44.4(CT) R92.1
OUT45: IC5.5(GPB4) OPTO45.4(CT) R93.1
OUT46: IC5.6(GPB5) OPTO46.4(CT) R94.1
OUT47: IC5.7(GPB6) OPTO47.4(CT) R95.1
OUT48: IC5.8(GPB7) OPTO48.4(CT) R96.1
OUT+: C6.+ C7.1 C8.1 D1.C(K) D50.C(K) D51.C(K) D107.C(K) JP1.1 K1.A1 K2.1 MT1.VIN+ Q5.3(C) Q6.3(C) Q7.3(C) Q8.3(C) R116.2 R123.2 R127.2 R130.2 R133.2 R136.2 R139.2 TTL-RS1.VCC U2.3(VIN)
P1: HEADER-29P1.1 R1.1
P2: HEADER-29P1.2 R2.1
P3: HEADER-29P1.3 R3.1
P4: HEADER-29P1.4 R4.1
P5: HEADER-29P1.5 R5.1
P6: HEADER-29P1.6 R6.1
P7: HEADER-29P1.7 R7.1
P8: HEADER-29P1.8 R8.1
P9: HEADER-29P1.9 R9.1
P10: HEADER-29P1.10 R10.1
P11: HEADER-29P1.11 R11.1
P12: HEADER-29P1.12 R12.1
P13: HEADER-29P1.13 R13.1
P14: HEADER-29P1.14 R14.1
P15: HEADER-29P1.15 R15.1
P16: HEADER-29P1.16 R16.1
P17: HEADER-29P1.17 R17.1
P18: HEADER-29P1.18 R18.1
P19: HEADER-29P1.19 R19.1
P20: HEADER-29P1.20 R20.1
P21: HEADER-29P1.21 R21.1
P22: HEADER-29P1.22 R22.1
P23: HEADER-29P1.23 R23.1
P24: HEADER-29P1.24 R24.1
P25: HEADER-29P1.25 R25.1
P26: HEADER-29P1.26 R26.1
P27: HEADER-29P1.27 R27.1
P28: HEADER-29P1.28 R28.1
P29: HEADER-29P1.29 R29.1
P30: HEADER-29P2.8 R30.1
P31: HEADER-29P2.9 R31.1
P32: HEADER-29P2.10 R32.1
P33: HEADER-29P2.11 R33.1
P34: HEADER-29P2.12 R34.1
P35: HEADER-29P2.13 R35.1
P36: HEADER-29P2.14 R36.1
P37: HEADER-29P2.15 R37.1
P38: HEADER-29P2.16 R38.1
P39: HEADER-29P2.17 R39.1
P40: HEADER-29P2.18 R40.1
P41: HEADER-29P2.19 R41.1
P42: HEADER-29P2.20 R42.1
P43: HEADER-29P2.21 R43.1
P44: HEADER-29P2.22 R44.1
P45: HEADER-29P2.23 R45.1
P46: HEADER-29P2.24 R46.1
P47: HEADER-29P2.25 R47.1
P48: HEADER-29P2.26 R48.1
RELAY: R115.2 U3.26(IO4)
RESET: IC1.18(!RESET) IC4.18(!RESET) IC5.18(!RESET) R103.2 R107.1 R111.2
RTS: Q2.2(E) R118.1 U1.14(!RTS)
RX: D53.C U1.3(RXD) U3.35(TXD0)
RX-RS485: TTL-RS1.RX U3.28(IO17)
RX_BACKUP: JP1.2 U3.9(IO33)
SCK_VSPI: U3.30(IO18) U$1.SCLK
SCL: IC1.12(SCL) IC4.12(SCL) IC5.12(SCL) R97.1 R99.1 R101.1 RTC1.SCL U3.36(IO22)
SDA: IC1.13(SDA) IC4.13(SDA) IC5.13(SDA) R98.1 R100.1 R102.1 RTC1.SDA U3.33(IO21)
SS_LAN: U3.29(IO5) U$1.CS
TESTING: R126.1 U3.14(IO12)
TESTING1: R129.1 U3.16(IO13)
TESTING2: R132.1 U3.13(IO14)
TESTING3: R135.1 U3.23(IO15)
TX: D52.C U1.2(TXD) U3.34(RXD0)
TX-RS485: TTL-RS1.TX U3.27(IO16)
TX_BACKUP: JP1.3 U3.8(IO32)
UJIDEVICE0: D55.A D56.A D57.A D58.A D59.A D60.A D61.A D62.A D63.A D64.A D65.A D66.A Q5.2(E) R128.2
UJIDEVICE00: D67.A D68.A D69.A D70.A D71.A D72.A D73.A D74.A D75.A D76.A D77.A D78.A Q6.2(E) R131.2
UJIDEVICE000: D79.A D80.A D81.A D82.A D83.A D84.A D85.A D86.A D87.A D88.A D89.A D90.A Q7.2(E) R134.2
UJIDEVICE0000: D91.A D92.A D93.A D94.A D95.A D96.A D97.A D98.A D99.A D100.A D101.A D102.A Q8.2(E) R137.2
UJIDEVICE1: D2.C(K) D55.C(K) LED1.+
UJIDEVICE2: D3.C(K) D56.C(K) LED2.+
UJIDEVICE3: D4.C(K) D57.C(K) LED3.+
UJIDEVICE4: D5.C(K) D58.C(K) LED4.+
UJIDEVICE5: D6.C(K) D59.C(K) LED5.+
UJIDEVICE6: D7.C(K) D60.C(K) LED6.+
UJIDEVICE7: D8.C(K) D61.C(K) LED7.+
UJIDEVICE8: D9.C(K) D62.C(K) LED8.+
UJIDEVICE9: D10.C(K) D63.C(K) LED9.+
UJIDEVICE10: D11.C(K) D64.C(K) LED10.+
UJIDEVICE11: D12.C(K) D65.C(K) LED11.+
UJIDEVICE12: D13.C(K) D66.C(K) LED12.+
UJIDEVICE13: D14.C(K) D67.C(K) LED13.+
UJIDEVICE14: D15.C(K) D68.C(K) LED14.+
UJIDEVICE15: D16.C(K) D69.C(K) LED15.+
UJIDEVICE16: D17.C(K) D70.C(K) LED16.+
UJIDEVICE17: D18.C(K) D71.C(K) LED17.+
UJIDEVICE18: D19.C(K) D72.C(K) LED18.+
UJIDEVICE19: D20.C(K) D73.C(K) LED19.+
UJIDEVICE20: D21.C(K) D74.C(K) LED20.+
UJIDEVICE21: D22.C(K) D75.C(K) LED21.+
UJIDEVICE22: D23.C(K) D76.C(K) LED22.+
UJIDEVICE23: D24.C(K) D77.C(K) LED23.+
UJIDEVICE24: D25.C(K) D78.C(K) LED24.+
UJIDEVICE25: D26.C(K) D79.C(K) LED25.+
UJIDEVICE26: D27.C(K) D80.C(K) LED26.+
UJIDEVICE27: D28.C(K) D81.C(K) LED27.+
UJIDEVICE28: D29.C(K) D82.C(K) LED28.+
UJIDEVICE29: D30.C(K) D83.C(K) LED29.+
UJIDEVICE30: D31.C(K) D84.C(K) LED30.+
UJIDEVICE31: D32.C(K) D85.C(K) LED31.+
UJIDEVICE32: D33.C(K) D86.C(K) LED32.+
UJIDEVICE33: D34.C(K) D87.C(K) LED33.+
UJIDEVICE34: D35.C(K) D88.C(K) LED34.+
UJIDEVICE35: D36.C(K) D89.C(K) LED35.+
UJIDEVICE36: D37.C(K) D90.C(K) LED36.+
UJIDEVICE37: D38.C(K) D91.C(K) LED37.+
UJIDEVICE38: D39.C(K) D92.C(K) LED38.+
UJIDEVICE39: D40.C(K) D93.C(K) LED39.+
UJIDEVICE40: D41.C(K) D94.C(K) LED40.+
UJIDEVICE41: D42.C(K) D95.C(K) LED41.+
UJIDEVICE42: D43.C(K) D96.C(K) LED42.+
UJIDEVICE43: D44.C(K) D97.C(K) LED43.+
UJIDEVICE44: D45.C(K) D98.C(K) LED44.+
UJIDEVICE45: D46.C(K) D99.C(K) LED45.+
UJIDEVICE46: D47.C(K) D100.C(K) LED46.+
UJIDEVICE47: D48.C(K) D101.C(K) LED47.+
UJIDEVICE48: D49.C(K) D102.C(K) LED48.+
USB_N: J3.2(D-) U1.6(UD-)
USB_P: J3.3(D+) U1.5(UD+)
VCC: C9.1 IC1.9(VDD) IC4.9(VDD) IC5.9(VDD) R49.2 R50.2 R51.2 R52.2 R53.2 R54.2 R55.2 R56.2 R57.2 R58.2 R59.2 R60.2 R61.2 R62.2 R63.2 R64.2 R65.2 R66.2 R67.2 R68.2 R69.2 R70.2 R71.2 R72.2 R73.2 R74.2 R75.2 R76.2 R77.2 R78.2 R79.2 R80.2 R81.2 R82.2 R83.2 R84.2 R85.2 R86.2 R87.2 R88.2 R89.2 R90.2 R91.2 R92.2 R93.2 R94.2 R95.2 R96.2 R97.2 R98.2 R99.2 R100.2 R101.2 R102.2 R103.1 R107.2 R108.1 R111.1 R113.1 R119.2 R120.2 R121.2 R122.2 RTC1.VCC U2.2(VOUT) U2.4(VOUT) U3.2(3V3) U$1.3V3 U$1.3V3.2
VUSB: C1.1 C2.+ D51.A J3.1(VUSB) U1.16(VCC)
Unconnected: IC4.19(INTB) IC4.20(INTA) J3.4(ID) K2.O2(3:O) K2.P2(3:P) K2.S2(3:S) RTC1.32K RTC1.GND1 RTC1.SCL1 RTC1.SDA1 RTC1.SQW RTC1.VCC1 U1.9(!CTS) U1.10(!DSR) U1.11(!RI) U1.12(!DCD) U1.15(RS232) U3.4(SENSOR_VP) U3.5(SENSOR_VN) U3.6(IO34) U3.7(IO35) U3.17(SHD/SD2) U3.18(SWP/SD3) U3.19(SCS/CMD) U3.20(SCK/CLK) U3.21(SDO/SD0) U3.22(SDI/SD1) U3.24(IO2) U$1.INT U$1.NC U$1.RST X1.2

## Notes on the sheet
- CH340 DRIVER
- POWER SUPPLY
- PB+LED
- ETHERNET
- ESP32
- TESTING
- TESTING
- TESTING
- TESTING
- DAS48P110V
- 10/03/2022

## Library data of the parts
C1 C3-C5 C7-C11 = rcl:C-EU: CAPACITOR, European symbol; SPICEPREFIX: C
C2 C6 = rcl:CPOL-EU: POLARIZED CAPACITOR, European symbol; SPICEPREFIX: C
D1 D107 = US1M-13:US1M-13: Diode, Fast Recovery, 1a, 1kv, Do-214ac-2, Full Reel Check availability <https://pricing.snapeda.com/parts/US1M-13/Diodes%20Incorporated/view-part?ref=eda>; AVAILABILITY: In Stock; DESCRIPTION: Diode Standard 1000 V 1A Surface Mount SMA; MF: Diodes Incorporated; MP: US1M-13; PACKAGE: DO-214AC-214 Diodes Incorporated; PRICE: None; PURCHASE-URL: https://pricing.snapeda.com/search/part/US1M-13/?ref=eda
D2-D51 D55-D102 = 1N5819HW-7:1N5819HW-7: 1N5819HW Series 40 V 1 A Surface Mount Schottky Barrier Rectifier - SOD-123 Check availability <https://pricing.snapeda.com/parts/1N5819HW-7/Diodes%20Inc./view-part?ref=eda>; AVAILABILITY: In Stock; DESCRIPTION: Diode Schottky 40 V 1A Surface Mount SOD-123; MF: Diodes Inc.; MP: 1N5819HW-7; PACKAGE: SOD-123 Fairchild Semiconductor; PRICE: None; PURCHASE-URL: https://pricing.snapeda.com/search/part/1N5819HW-7/?ref=eda
D52-D54 D103-D105 = SML-LXT0805IW-TR:SML-LXT0805IW-TR: LED; Luminous Intensity:11µcd; Viewing Angle:140°; Forward Current:30mA; Forward Voltage:2V; Color:Red; LED Color:Red; Leaded Process Compatible:Yes; Lens Color:White; Mounting Type:Surface Mount ;RoHS Compliant: Yes Check availability <https://pricing.snapeda.com/parts/SML-LXT0805IW-TR/Lumex%20Opto/Components/view-part?ref=eda>; AVAILABILITY: In Stock; DESCRIPTION: Red - LED Indication - Discrete 2V 0805 (2012 Metric); MF: Lumex Opto/Components; MP: SML-LXT0805IW-TR; PACKAGE: 0805 Lumex; PRICE: None; PURCHASE-URL: https://pricing.snapeda.com/search/part/SML-LXT0805IW-TR/?ref=eda
D146 LED1-LED48 = LHN974_RED_LED_1206:LHN974_RED_LED_1206: LED Chip 1206 Check availability <https://pricing.snapeda.com/parts/LHN974%20RED%20LED%201206/Osram/view-part?ref=eda>; AVAILABILITY: Not in stock; DESCRIPTION: 2.6 V Red LED SMD; MF: Osram; MP: LHN974 RED LED 1206; PACKAGE: None; PRICE: None
HEADER-29P1 HEADER-29P2 = HEADER-29P:HEADER-29P
IC1 IC4 IC5 = adafruit_edited:MCP23017: http://ww1.microchip.com/downloads/en/DeviceDoc/21952a.pdf Source: http://ww1.microchip.com/downloads/en/DeviceDoc/21952a.pdf
J3 = 10118193-0001LF:10118193-0001LF: Micro USB B Type Receptacle Check availability <https://pricing.snapeda.com/parts/10118193-0001LF/FCI/view-part?ref=eda>; AVAILABILITY: In Stock; DESCRIPTION: USB - micro B USB 2.0 Receptacle Connector 5 Position Surface Mount, Right Angle; Through Hole; MF: FCI; MP: 10118193-0001LF; PACKAGE: None; PRICE: None; PURCHASE-URL: https://pricing.snapeda.com/search/part/10118193-0001LF/?ref=eda
JP1 = pinhead:PINHD-1X4: PIN HEADER
K1 = SRD-05VDC-SL-C:SRD-05VDC-SL-C: 5V Trigger Relay Module For Arduino And Raspberry Pi 5V Trigger Relay Module For Arduino And Raspberry Pi Check availability <https://pricing.snapeda.com/parts/SRD-05VDC-SL-C/Songle%20Relay/view-part?ref=eda>; AVAILABILITY: Not in stock; DESCRIPTION: 5V Trigger Relay Module For Arduino And Raspberry Pi 5V Trigger Relay Module For Arduino And Raspberry Pi; MF: Songle Relay; MP: SRD-05VDC-SL-C; PACKAGE: None; PRICE: None
K2 = relay:351: RELAY 2 x switch, Omron; OC_FARNELL: unknown; OC_NEWARK: unknown
MT1 = MT3608:MT3608
OPTO1-OPTO48 U4-U8 U49 = PC817X2NIP0F:PC817X2NIP0F: PC817 Series 1 Channel 80 V 5000 Vrms General Purpose Photocoupler - DIP-4 Check availability <https://pricing.snapeda.com/parts/PC817X2NIP0F/Sharp%20Microelectronics/view-part?ref=eda>; AVAILABILITY: Not in stock; DESCRIPTION: Optoisolator Transistor Output 5000Vrms 1 Channel 4-SMD; MF: Sharp Microelectronics; MP: PC817X2NIP0F; PACKAGE: SMD-4 Sharp Microelectronics; PRICE: None
POWER PROSES WARNING = led:TLLY4400: Low Current (2mA) LED 3 mm Tinted Diffused Package color YELLOW Source: Data sheet <http://www.farnell.com/datasheets/391098.pdf>; MF: VISHAY SEMICONDUCTOR; OC_FARNELL: 1612439
PS2 = HLK-10M05:HLK-10M05: HI-LINK HLK-10M05 Manufacturer : HI-LINK <https://lcsc.com//brand-detail/11515.html> Mfr.Part # HLK-10M05 LCSC Part # C403745 <https://lcsc.com/product-detail/show_C403745.html> Package : Through Hole Datasheet :  EasyEDA Model <javascript:void(0);> Power Module AC-DC Through Hole RoHS Source: Datasheet <https://datasheet.lcsc.com/szlcsc/1909111105_HI-LINK-HLK-10M05_C403745.pdf> Check availability <https://pricing.snapeda.com/parts/HLK-10M05/Hi-link/view-part?ref=eda>; AVAILABILITY: Not in stock; DESCRIPTION: 10W Ultra-Compact Power Module; MF: Hi-link; MP: HLK-10M05; PACKAGE: Package; PRICE: None
Q1 Q5-Q9 = S9013:S9013: SMD Transistors NPN 25V-500mA Check availability <https://pricing.snapeda.com/parts/S9013/JCET/view-part?ref=eda>; AVAILABILITY: Not in stock; DESCRIPTION: Bipolar (BJT) Transistor NPN 20V 500mA 625mW Through Hole TO-92-3; MF: JCET; MP: S9013; PACKAGE: SOT-23-3 JCET; PRICE: None
Q2 Q3 = MMBT3904:MMBT3904: MMBT3904 Series 40 V CE Breakdown 0.2 A NPN General Purpose Amplifier - SOT-23 Check availability <https://pricing.snapeda.com/parts/MMBT3904/ON%20Semiconductor/view-part?ref=eda>; AVAILABILITY: In Stock; DESCRIPTION: Bipolar (BJT) Transistor NPN 40 V 200 mA 300MHz 300 mW Surface Mount SOT-23-3 (TO-236); MF: ON Semiconductor; MP: MMBT3904; PACKAGE: SOT-23-3 Motorola; PRICE: None
Q4 = crystal:CRYSTAL: CRYSTAL; OC_FARNELL: unknown; OC_NEWARK: unknown
R1-R116 = rcl:R-EU_: RESISTOR, European symbol; SPICEPREFIX: R
R117-R139 = adafruit:R-US_: RESISTOR, American symbol
RTC1 = rtc3231:RTC3231
S1 S3 = switch-omron:31-XX: OMRON SWITCH; MPN: B3F-3100; OC_FARNELL: 959704; OC_NEWARK: 36M3582
TTL-RS1 = TTL-RS485:TTL-RS485
U1 = CH340G:CH340G: Check availability <https://pricing.snapeda.com/parts/Ch340G/WCH/view-part?ref=eda>; AVAILABILITY: Not in stock; DESCRIPTION: USB Interface Integrated Circuit; MF: WCH; MP: Ch340G; PACKAGE: None; PRICE: None
U2 = AMS1117:AMS1117: Sot223/Pkg 1-Amp 5-Volt Low Drop Out Voltage Regulatator Check availability <https://pricing.snapeda.com/parts/AMS1117/Advanced%20Monolithic%20Systems/view-part?ref=eda>; AVAILABILITY: Not in stock; DESCRIPTION: 1A LOW DROPOUT VOLTAGE REGULATOR SOT-223; MF: Advanced Monolithic Systems; MP: AMS1117; PACKAGE: SOT-223 Seeed Technology; PRICE: None
U3 = ESP32-WROOM-32D:ESP32-WROOM-32D: Bluetooth, WiFi 802.11b/g/n, Bluetooth v4.2 + EDR, Class 1, 2 and 3 Transceiver Module 2.4GHz ~ 2.5GHz Integrated, Trace Surface Mount Check availability <https://pricing.snapeda.com/parts/ESP32-WROOM-32D/Espressif%20Systems/view-part?ref=eda>; AVAILABILITY: In Stock; DESCRIPTION: Bluetooth, WiFi 802.11b/g/n, Bluetooth v4.2 +EDR, Class 1, 2 and 3 Transceiver Module 2.4GHz ~ 2.5GHz Integrated; MF: Espressif Systems; MP: ESP32-WROOM-32D; PACKAGE: Module Espressif Systems; PRICE: None; PURCHASE-URL: https://pricing.snapeda.com/search/part/ESP32-WROOM-32D/?ref=eda
U$1 = ethernet-mikroavr:MINI_W5500: MINI ETHERNET W5500, CREATE BY MIKROAVR.COM
X1 = con-molex:22-23-2031: .100" (2.54mm) Center Header - 3 Pin; MF: MOLEX; MPN: 22-23-2031; OC_FARNELL: 1462950; OC_NEWARK: 30C0862
Z1-Z48 = diode:DIODE-: DIODE

## Net classes
0 default: drill 0.3 mm, clearance 0.2 mm